# Altium project ProPCB.PrjPCB
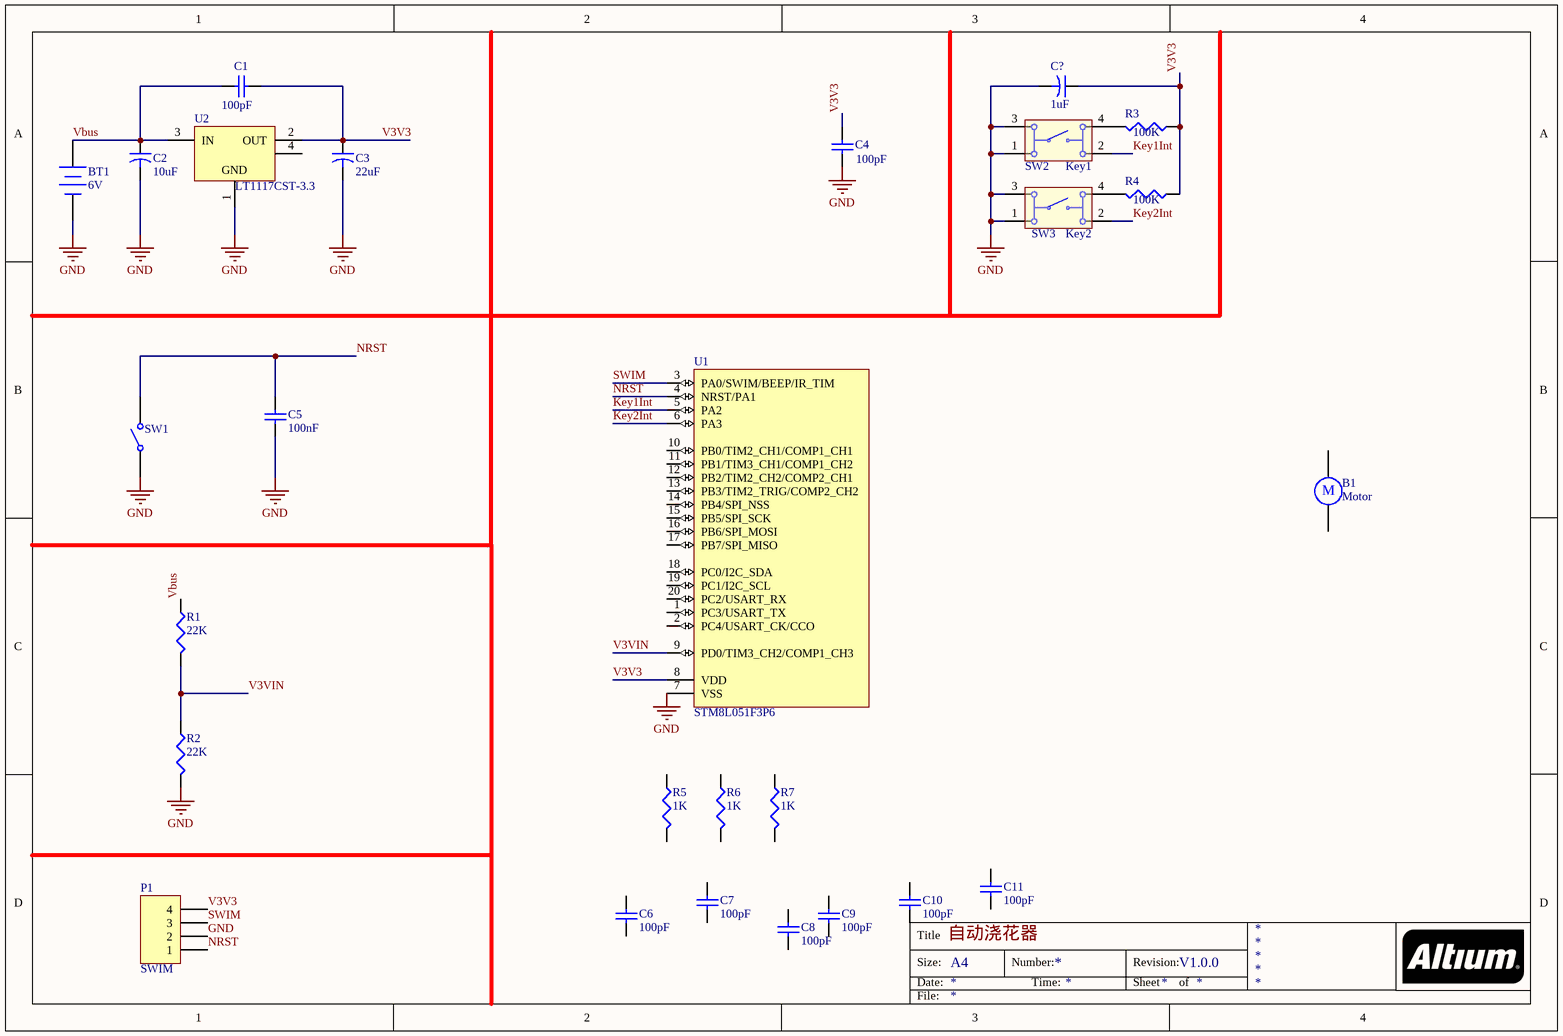
[diagram p0: ProSheet.SchDoc]
1 sheet, 27 parts. Net scope: global (net labels, ports and power ports of the same name join across sheets).
Board file: ProPCB.PcbDoc

## Sheet ProSheet.SchDoc: 自动浇花器
size A4; Author: Bert; Revision: V1.0.0

### Parts
B1  Motor  [RB5-10.5]
BT1  6V  [BAT-2]
C1  value 100pF  [C1206]  (hidden comment: Cap Semi)
C2  value 10uF  [CAPR5-4X5]  (hidden comment: Cap2)
C3  value 22uF  [CAPR5-4X5]  (hidden comment: Cap2)
C4  value 100pF  [C1206]  (hidden comment: Cap Semi)
C5  value 100nF  [0402]  (hidden comment: Cap Semi)
C6  value 100pF  [0402]  (hidden comment: Cap Semi)
C7  value 100pF  [0402]  (hidden comment: Cap Semi)
C8  value 100pF  [0402]  (hidden comment: Cap Semi)
C9  value 100pF  [0402]  (hidden comment: Cap Semi)
C10  value 100pF  [0402]  (hidden comment: Cap Semi)
C11  value 100pF  [0402]  (hidden comment: Cap Semi)
C?  value 1uF  [CAPR5-4X5]  (hidden comment: Cap2)
P1  SWIM  [HDR1X4]
R1  value 22K  [J1-0603]  (hidden comment: Res3)
R2  value 22K  [J1-0603]  (hidden comment: Res3)
R3  value 100K  [J1-0603]  (hidden comment: Res3)
R4  value 100K  [J1-0603]  (hidden comment: Res3)
R5  value 1K  [J1-0603]  (hidden comment: Res3)
R6  value 1K  [J1-0603]  (hidden comment: Res3)
R7  value 1K  [J1-0603]  (hidden comment: Res3)
SW1  434123050836  [434123050836]  (value not drawn)
SW2  Key1  [430186130716]
SW3  Key2  [430186130716]
U1  STM8L051F3P6  [TSSOP20_N]
U2  LT1117CST-3.3  [LT-ST-3-SOT-223_N]

### Nets
GND: BT1.2(-) C2.2 C3.2 C4.1 C5.2 C?.2 P1.2 R2.2 SW1.1 SW2.1 SW2.3 SW3.1 SW3.3 U1.7(VSS) U2.1(GND)
Key1Int: SW2.2 U1.5(PA2)
Key2Int: SW3.2 U1.6(PA3)
NRST: C5.1 P1.1 SW1.2 U1.4(NRST/PA1)
SWIM: P1.3 U1.3(PA0/SWIM/BEEP/IR_TIM)
V3V3: C1.2 C3.1 C4.2 C?.1 P1.4 R3.1 R4.1 U1.8(VDD) U2.2(OUT)
V3VIN: R1.2 R2.1 U1.9(PD0/TIM3_CH2/COMP1_CH3)
Vbus: BT1.1(+) C1.1 C2.1 R1.1 U2.3(IN)
NetR3_2: R3.2 SW2.4
NetR4_2: R4.2 SW3.4

Not connected (* = marked no-connect by the designer): B1 1 2; C6 1 2; C7 1 2; C8 1 2; C9 1 2; C10 1 2; C11 1 2; R5 1 2; R6 1 2; R7 1 2; U1 1(PC3/USART_TX) 2(PC4/USART_CK/CCO) 10(PB0/TIM2_CH1/COMP1_CH1) 11(PB1/TIM3_CH1/COMP1_CH2) 12(PB2/TIM2_CH2/COMP2_CH1) 13(PB3/TIM2_TRIG/COMP2_CH2) 14(PB4/SPI_NSS) 15(PB5/SPI_SCK) 16(PB6/SPI_MOSI) 17(PB7/SPI_MISO) 18(PC0/I2C_SDA) 19(PC1/I2C_SCL) 20(PC2/USART_RX); U2 4(VOUT)

### Notes on the sheet
- Title
- Size:
- Date:
- A4
- Number:
- Time:
- Revision:
- Sheet
- of
- File:
- (in symbol Motor) M

### Library data of the parts
B1 = Motor: Motor, General Kind; Published: 24-Mar-1999; LatestRevisionDate: 17-Jul-2002; LatestRevisionNote: Re-released for DXP Platform.; PackageReference: RB5-10.5; Publisher: Altium Limited; PackageDescription: Capacitor (Radial); 2 Leads
BT1 = Battery: Multicell Battery; Published: 24-Mar-1999; LatestRevisionDate: 17-Jul-2002; LatestRevisionNote: Re-released for DXP Platform.; PackageReference: BAT-2; Publisher: Altium Limited; PackageDescription: Battery; 2 Leads
C1 C4-C11 = Cap Semi: Capacitor (Semiconductor SIM Model); Published: 8-Jun-2000; LatestRevisionDate: 29-May-2009; LatestRevisionNote: IPC-7351 Footprint Added.; PackageReference: C1206; Publisher: Altium Limited; PackageDescription: Chip Capacitor
C2 C3 C? = Cap2: Capacitor; Published: 23-Sep-2002; PackageReference: CAPR5-4X5; Publisher: Altium Limited; PackageDescription: Capacitor; 2 Leads
P1 = Header 4: Header, 4-Pin; LatestRevisionDate: 17-Jul-2002; LatestRevisionNote: Re-released for DXP Platform.; Publisher: Altium Limited
R1-R7 = Res3: Resistor; Published: 8-Jun-2000; LatestRevisionDate: 29-May-2009; LatestRevisionNote: IPC-7351 Footprint Added.; PackageReference: J1-0603; Publisher: Altium Limited; PackageDescription: Chip Resistor
SW1 = 434123050836: WS-TASV J-Bend SMD Tact Switch 6.0X3.5 mm; NoPins: 02; PackageReference: 434123050836; PartNumber: 434123050836; ComponentLink1Description: Manufacturer URL; ComponentLink1URL: http://www.we-online.com; ComponentLink2Description: Datasheet; ComponentLink2URL: http://katalog.we-online.de/em/datasheet/434123050836.pdf
SW2 SW3 = 430186130716: WS-TATV THT Tact Switch 6X6 mm; NoPins: 04; PackageReference: 430186130716; PartNumber: 430186130716; ComponentLink1Description: Manufacturer URL; ComponentLink1URL: http://www.we-online.com; ComponentLink2Description: Datasheet; ComponentLink2URL: http://katalog.we-online.de/em/datasheet/4301x6.pdf
U1 = STM8L101F3P6: STM8L ARM-based EnergyLite 8-bit MCU, 8 kB Flash, 1.5 kB Internal RAM, -40 to +85癈 Temperature, 20-pin TSSOP, Tube; PackageVersion: 2010; PackageReference: TSSOP20; PackageDescription: 20-Pin Thin Shrink Small Package Outline 0.65 mm Pitch; ComponentLink1Description: Manufacturer URL; ComponentLink1URL: http://www.st.com/; ComponentLink2Description: STM8L101 Datasheet; ComponentLink2URL: http://www.st.com/internet/com/TECHNICAL_RESOURCES/TECHNICAL_LITERATURE/DATASHEET/CD00220591.pdf; ComponentLink3Description: STM8L Family Web Page; ComponentLink3URL: http://www.st.com/internet/mcu/subclass/1381.jsp
U2 = LT1117CST-3.3: 0.8 A Low Dropout Positive Regulator, 2.45 to 15 V Vin, 3.3 V Vout, 3-pin SOT223 (ST-3), 0 to 125 degC; Manufacturer: Linear Technology; Discrete Pass Element: no; Dropout Voltage(V): 1.1; Iout(mA): 800; Isupply(mA): 5; Number of Outputs: 1; Output Voltage: 3.3 V; PSRR(dB): 75; Vin Max(V): 15; Vin Min(V): 2.45; DatasheetVersion: Rev. D; PackageVersion: Jun-10; PackageReference: ST-3; PackageDescription: 3-Pin Plastic SOT-223, 3.505 x 6.505 mm Body, Pitch 2.3 mm; Supplier 1: Digi-Key; Supplier Part Number 1: LT1117CST-3.3-ND; Supplier 2: Newark; Supplier Part Number 2: 57M1797; RoHS: FALSE; Mounting Technology: Surface Mount; PartNumber: LT1117CST-3.3; ComponentLink1Description: Manufacturer URL; ComponentLink1URL: http://www.linear.com/; ComponentLink2Description: Datasheet; ComponentLink2URL: http://cds.linear.com/docs/en/datasheet/1117fd.pdf; ComponentLink3Description: Package Specification; ComponentLink3URL: http://cds.linear.com/docs/en/packaging/SOT_3_05-08-1630.pdf